# Altium schematic sheet STM32_microcontroller_power.SchDoc: STM32 microcontroller power part
size A4; Date: Not used; ApprovedBy: Not used; CheckedBy: Not used; Author: Not used; CompanyName: STMicroelectronics; DrawnBy: Not used; Engineer: Not used; Organization: Not used; Address1: Not used; Address2: Not used; Address3: Not used; Address4: Not used; DocumentNumber: 4; Revision: Not used; SheetNumber: 4; SheetTotal: 8; CurrentTime: Not used; CurrentDate: Not used; Time: Not used; DocumentFullPathAndName: Not used; DocumentName: Not used; ModifiedDate: Not used; ImagePath: Not used; ProjectName: Not used; Application_BuildNumber: Not used
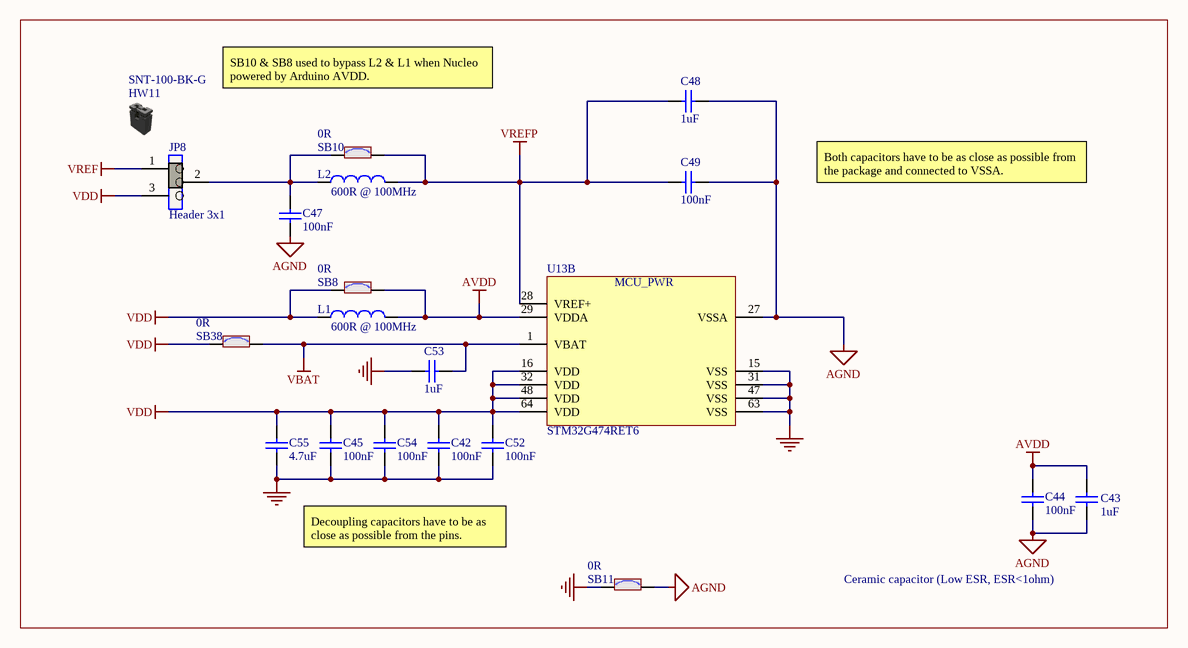
[diagram p0: STM32_microcontroller_power.SchDoc]

## Parts
C42  value 100nF  [C0402]  (hidden comment: Capacitor)
C43  value 1uF  [C0603]
C44  value 100nF  [C0402]  (hidden comment: Capacitor)
C45  value 100nF  [C0402]  (hidden comment: Capacitor)
C47  value 100nF  [C0402]  (hidden comment: Capacitor)
C48  value 1uF  [C0603]
C49  value 100nF  [C0402]  (hidden comment: Capacitor)
C52  value 100nF  [C0402]  (hidden comment: Capacitor)
C53  value 1uF  [C0603]
C54  value 100nF  [C0402]  (hidden comment: Capacitor)
C55  value 4.7uF  [C0603]
HW11  value SNT-100-BK-G  (mechanical)
JP8  value Header 3x1  [CON_SAMTEC_TSW-103-07-F-S]
L1  value 600R @ 100MHz  [L0603]
L2  value 600R @ 100MHz  [L0603]
SB8  value 0R  [SOLDER-BRIDGE_R0603-0R]
SB10  value 0R  [SOLDER-BRIDGE_R0603-0R]
SB11  value 0R  [SOLDER-BRIDGE_R0603-0R]
SB38  value 0R  [SOLDER-BRIDGE_R0603-0R]
U13  value STM32G474RET6  [ICC_LQFP64_10X10_P050_SOCKET_YAMAICHI_IC149-064-069-B5_NM]  (part B of 2)

## Blocks framed on the sheet
Ceramic capacitor (Low ESR, ESR<1ohm): C42-C45 C47-C49 C52-C55 HW11 JP8 L1 L2 SB8 SB10 SB11 SB38 U13

## Nets
AGND: C43.1 C44.1 C47.1 C48.2 C49.2 SB11.2 U13.27(VSSA)
AVDD: C43.2 C44.2 L1.2 SB8.2 U13.29(VDDA)
GND: C42.1 C45.1 C52.1 C53.1 C54.1 C55.1 SB11.1 U13.15(VSS) U13.31(VSS) U13.47(VSS) U13.63(VSS)
VBAT: C53.2 SB38.2 U13.1(VBAT)
VDD: C42.2 C45.2 C52.2 C54.2 C55.2 JP8.3 L1.1 SB8.1 SB38.1 U13.16(VDD) U13.32(VDD) U13.48(VDD) U13.64(VDD)
VREF: JP8.1
VREFP: C48.1 C49.1 L2.2 SB10.2 U13.28(VREF+)
NetC47_2: C47.2 JP8.2 L2.1 SB10.1

## Notes on the sheet
- SB10 & SB8 used to bypass L2 & L1 when Nucleo powered by Arduino AVDD.
- Both capacitors have to be as close as possible from the package and connected to VSSA.
- Decoupling capacitors have to be as close as possible from the pins.
- Title:
- Project:
- Size:
- Revision:
- Variant:
- A4
- -
- Date:
- Reference:
- Sheet:
- of
- (in symbol MCD-01243, part B) MCU_PWR

## Library data of the parts
C42 C44 C45 C47 C49 C52 C54 = MCD-00006: Capacitor, MLCC, 100nF, 16V, X7R, +/-10%, 0402, T=0.5mm; Manufacturer_Part_Number: CC0402KRX7R7BB104; Manufacturer: YAGEO; Part_Preference: Recommended; Partial_Alternate_Internal_Part_Number: MCD-03299; Order_Code_RS: 9402047; Component_Country_Of_Origin: China; ShowFields: YES; ID: 2474; Internal_Part_Number: MCD-00006; Status: Released; Package: 0402; Part_Type: Capacitor; ComponentLink1URL: http://tunmcdsvn.tun.st.com/Component_Documentation_Library/Trunk/Capacitor/YAGEO_X7R_Series; Order_Code_Digikey: 311-1338-1-ND; Order_Code_Farnell: 9402047
C43 C48 C53 = MCD-00010: Capacitor, MLCC, 1uF, 16V, X5R, 10%, 0603, T=0,8mm; Manufacturer_Part_Number: CC0603KRX5R7BB105; Manufacturer: YAGEO; Part_Preference: Recommended; Provided_By: Subcon; Initial_Board_Reference: MB1274; Component_Country_Of_Origin: China; ID: 2470; Order_Code_RS: 2370680; ShowFields: YES; Internal_Part_Number: MCD-00010; Status: Released; Package: 0603; ComponentLink1Description: Yageo_Capacitor_X5R-series.pdf; ECCN_US: n/a; ECCN_EU: n/a; Part_Type: Capacitor; ComponentLink1URL: http://tunmcdsvn.tun.st.com/Component_Documentation_Library/Trunk/Capacitor/YAGEO_X5R_Series; Order_Code_Digikey: 311-1444-1-ND; Order_Code_Farnell: 2370680
C55 = MCD-00009: Capacitor, MLCC, 4.7uF, 16V, X5R, 10%, 0603, T=0.8mm; Manufacturer_Part_Number: CC0603KRX5R7BB475; Manufacturer: YAGEO; Part_Preference: Recommended; Partial_Alternate_Internal_Part_Number: MCD-03565; Provided_By: subcon; Initial_Board_Reference: MB1274; Alternate_EMS: A; Component_Country_Of_Origin: China; ID: 2471; ShowFields: YES; Internal_Part_Number: MCD-00009; ComponentLink1Description: Yageo_Capacitor_X5R-series.pdf; ECCN_US: n/a; ECCN_EU: n/a; Status: Released; Part_Type: Capacitor; Package: 0603; ComponentLink1URL: http://tunmcdsvn.tun.st.com/Component_Documentation_Library/Trunk/Capacitor/YAGEO_X5R_Series; Order_Code_Digikey: 311-1785-1-ND; Order_Code_Farnell: N/A; Order_Code_RS: N/A
HW11 = MCD-00043: SHUNT 2.54mm BLACK; Manufacturer: SAMTEC; Part_Type: Misc; Manufacturer_HQ_COO: Unknown; Part_Preference: Recommended; Partial_Alternate_Internal_Part_Number: MCD-01849, MCD-01864, MCD-02388, MCD-03991, MCD-04284, MCD-04580; Provided_By: Subcon; Initial_Board_Reference: MB1274; Alternate_EMS: A; Component_Country_Of_Origin: China, Costa Rica, Malaysia, USA, Vietnam; ID: 2551; Order_Code_RS: 158-7784; ShowFields: YES; Internal_Part_Number: MCD-00043; ECCN_US: n/a; ECCN_EU: n/a; Manufacturer_Part_Number: SNT-100-BK-G; ComponentLink1Description: Samtec_Shunt_Jumper_SNT100.pdf; Status: Released; ComponentLink1URL: http://tunmcdsvn.tun.st.com/Component_Documentation_Library/Trunk/Misc/SAMTEC_SNT-100-BK-G; Order_Code_Digikey: SAM8858-ND; Order_Code_Farnell: 2505007; Package: 2.54x5.08mm
JP8 = MCD-00684: Header, 3x1, 2,54mm, VR, TH, Height 5.84mm/2.54mm - Shunt Fitted 1-2 by default; Part_Type: Connector; Manufacturer_Part_Number: TSW-103-07-F-S; Manufacturer: SAMTEC; Part_Preference: Recommended; Partial_Alternate_Internal_Part_Number: MCD-03595, MCD-03723, MCD-03849, MCD-03980, MCD-04583; Provided_By: SUBCO; Component_Country_Of_Origin: China, Costa Rica, Malaysia, USA, Vietnam; ID: 3059; Order_Code_RS: 161-2248; ShowFields: YES; Internal_Part_Number: MCD-00684; Status: Released; ComponentLink1Description: Datasheet; ComponentLink1URL: http://tunmcdsvn.tun.st.com/Component_Documentation_Library/Trunk/Connector/SAMTEC_TSW_Series/; ECCN_US: n/a; ECCN_EU: n/a; Order_Code_Digikey: SAM8995-ND; Order_Code_Farnell: 2505043
L1 L2 = MCD-00047: SMD Chip ferrite bead, 600R@100MHz +/-25%, 350mA, 500mohm DC, 0603, T=0.8mm; Part_Type: Inductor; Manufacturer_Part_Number: FCM1608KF-601T03; Manufacturer: TAI-TECH; Part_Preference: Recommended; Partial_Alternate_Internal_Part_Number: MCD-02959; Provided_By: SUBCO; Component_Country_Of_Origin: Unknown; ID: 2546; ShowFields: YES; Internal_Part_Number: MCD-00047; Status: Released; ComponentLink1Description: Datasheet; ComponentLink1URL: http://tunmcdsvn.tun.st.com/Component_Documentation_Library/Trunk/Inductor/TAI-TECH_FCM-1608_Series; ECCN_US: n/a; ECCN_EU: n/a; Order_Code_Digikey: N/A; Order_Code_Farnell: N/A; Order_Code_RS: N/A; Package: 0603
SB8 SB10 SB11 SB38 = MCD-00071: Solder Bridge ON; Part_Type: Resistor; Manufacturer_Part_Number: RC0603JR-070RL; Manufacturer: YAGEO; Manufacturer_HQ_COO: Unknown; Part_Preference: Recommended; Provided_By: SUBCO; Component_Country_Of_Origin: China; ID: 2521; Order_Code_RS: 199-5647; ShowFields: YES; Internal_Part_Number: MCD-00071; ECCN_US: n/a; ECCN_EU: n/a; Status: Released; Package: 0603; ComponentLink1Description: Datasheet; ComponentLink1URL: http://tunmcdsvn.tun.st.com/Component_Documentation_Library/Trunk/Resistor/YAGEO_RC_Series; Order_Code_Digikey: 311-0.0GRTR-ND; Order_Code_Farnell: 2421846
U13 = MCD-01243: STM32G474, LQFP64 package,  3D IC footprint with 2D socket footprint.; Manufacturer: STMICROELECTRONICS; BMS_Part_Number: 9175326; Manufacturer_HQ_COO: EU; Part_Preference: Recommended; Provided_By: SUBCO with ST control; ECCN_US: 3A991A2; ECCN_EU: NEC; Component_Country_Of_Origin: China; ID: 3257; Order_Code_RS: 193-9861; ShowFields: YES; Internal_Part_Number: MCD-01243; Status: Released; Part_Type: IC; Manufacturer_Part_Number: STM32G474RET6; Package: LQFP64; ComponentLink1Description: Datasheet; ComponentLink1URL: http://tunmcdsvn.tun.st.com/Component_Documentation_Library/Trunk/IC/STMICROELECTRONICS_STM32G474RET6; Order_Code_Digikey: 497-STM32G474RET6-ND; Order_Code_Farnell: 3132418